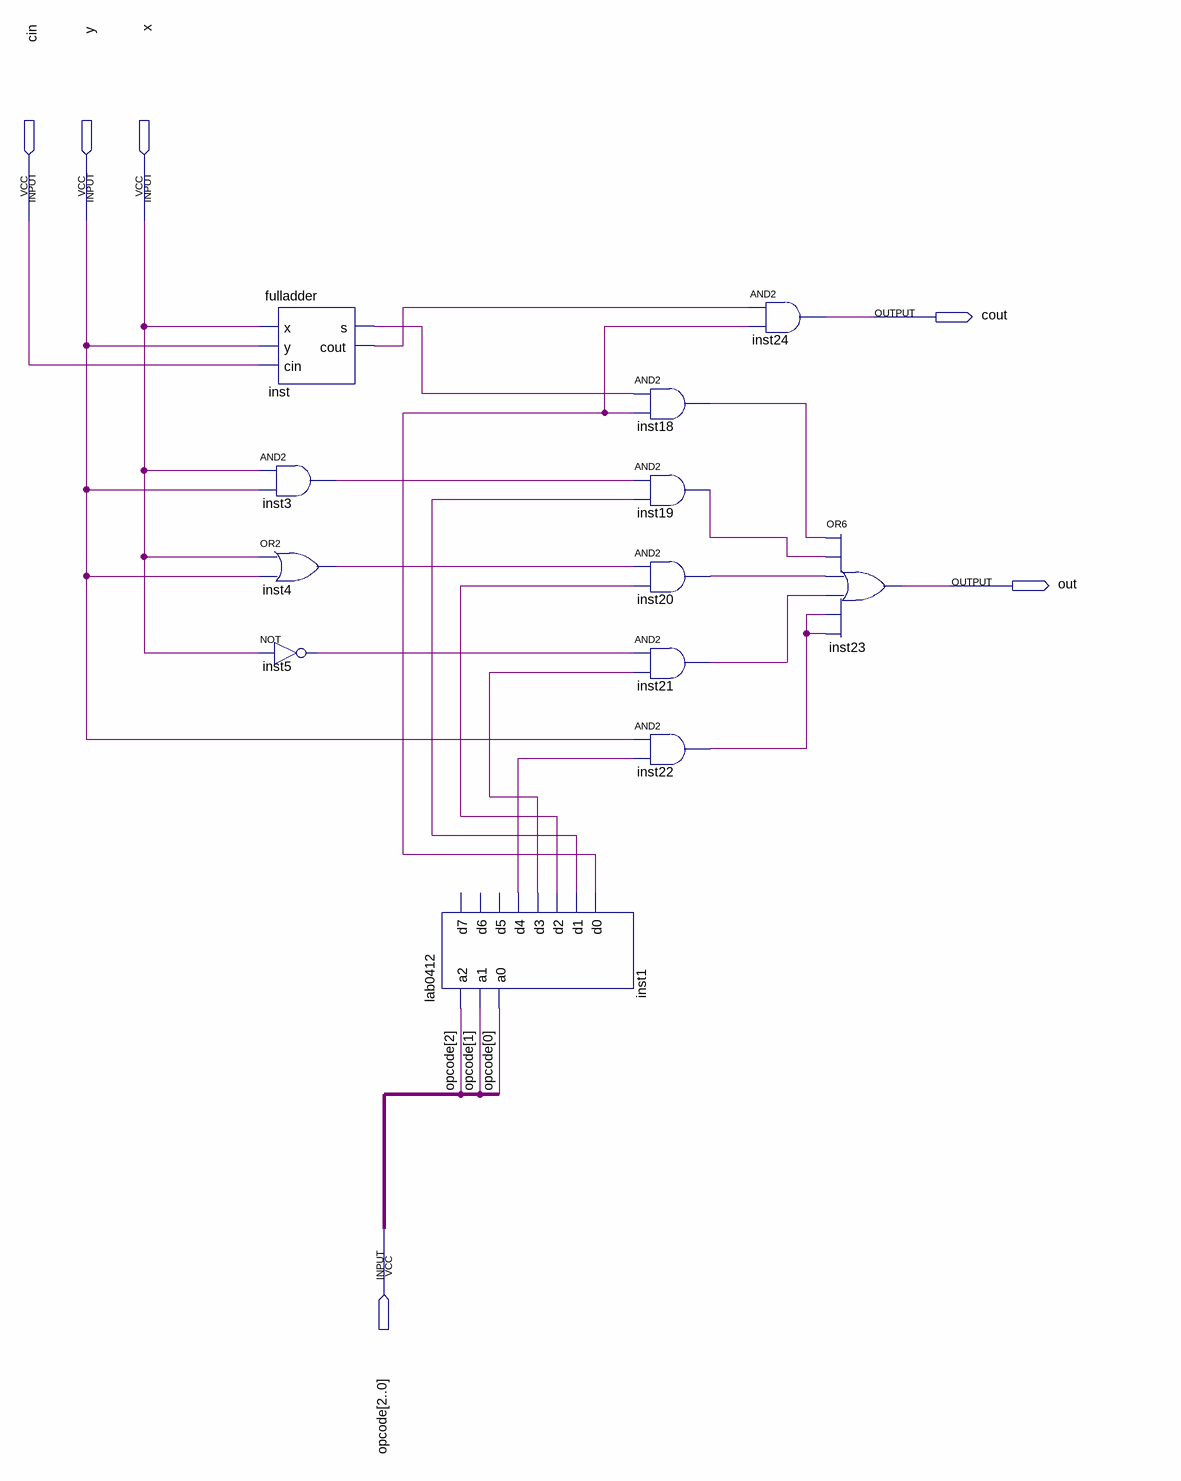
[diagram p0: schematic sheet]
// Quartus schematic ulaumbit.bdf as structural Verilog: 12 symbols, 6 pins
module ulaumbit (
  input  cin,
  input  y,
  input  x,
  input  [2:0] opcode,
  output cout,
  output out
);

  wire inst1_d0, inst1_d1, inst1_d2, inst1_d3, inst1_d4, inst3_out, inst4_out, inst5_out, inst18_out,
       inst19_out, inst20_out, inst21_out, inst22_out, inst_cout, inst_s;

  fulladder inst (.x(x), .y(y), .cin(cin), .s(inst_s), .cout(inst_cout));
  and inst3 (inst3_out, x, y);
  or inst4 (inst4_out, x, y);
  not inst5 (inst5_out, x);
  lab0412 inst1 (
    .a2(opcode[2]), .a1(opcode[1]), .a0(opcode[0]), .d4(inst1_d4), .d3(inst1_d3), .d2(inst1_d2),
    .d1(inst1_d1), .d0(inst1_d0));  // open: d7, d6, d5
  and inst18 (inst18_out, inst_s, inst1_d0);
  and inst19 (inst19_out, inst3_out, inst1_d1);
  and inst20 (inst20_out, inst4_out, inst1_d2);
  and inst21 (inst21_out, inst5_out, inst1_d3);
  and inst22 (inst22_out, y, inst1_d4);
  and inst24 (cout, inst_cout, inst1_d0);
  or inst23 (out, inst18_out, inst19_out, inst20_out, inst21_out, inst22_out, inst22_out);
endmodule
